# EAGLE design pci (EAGLE 6.5.0)
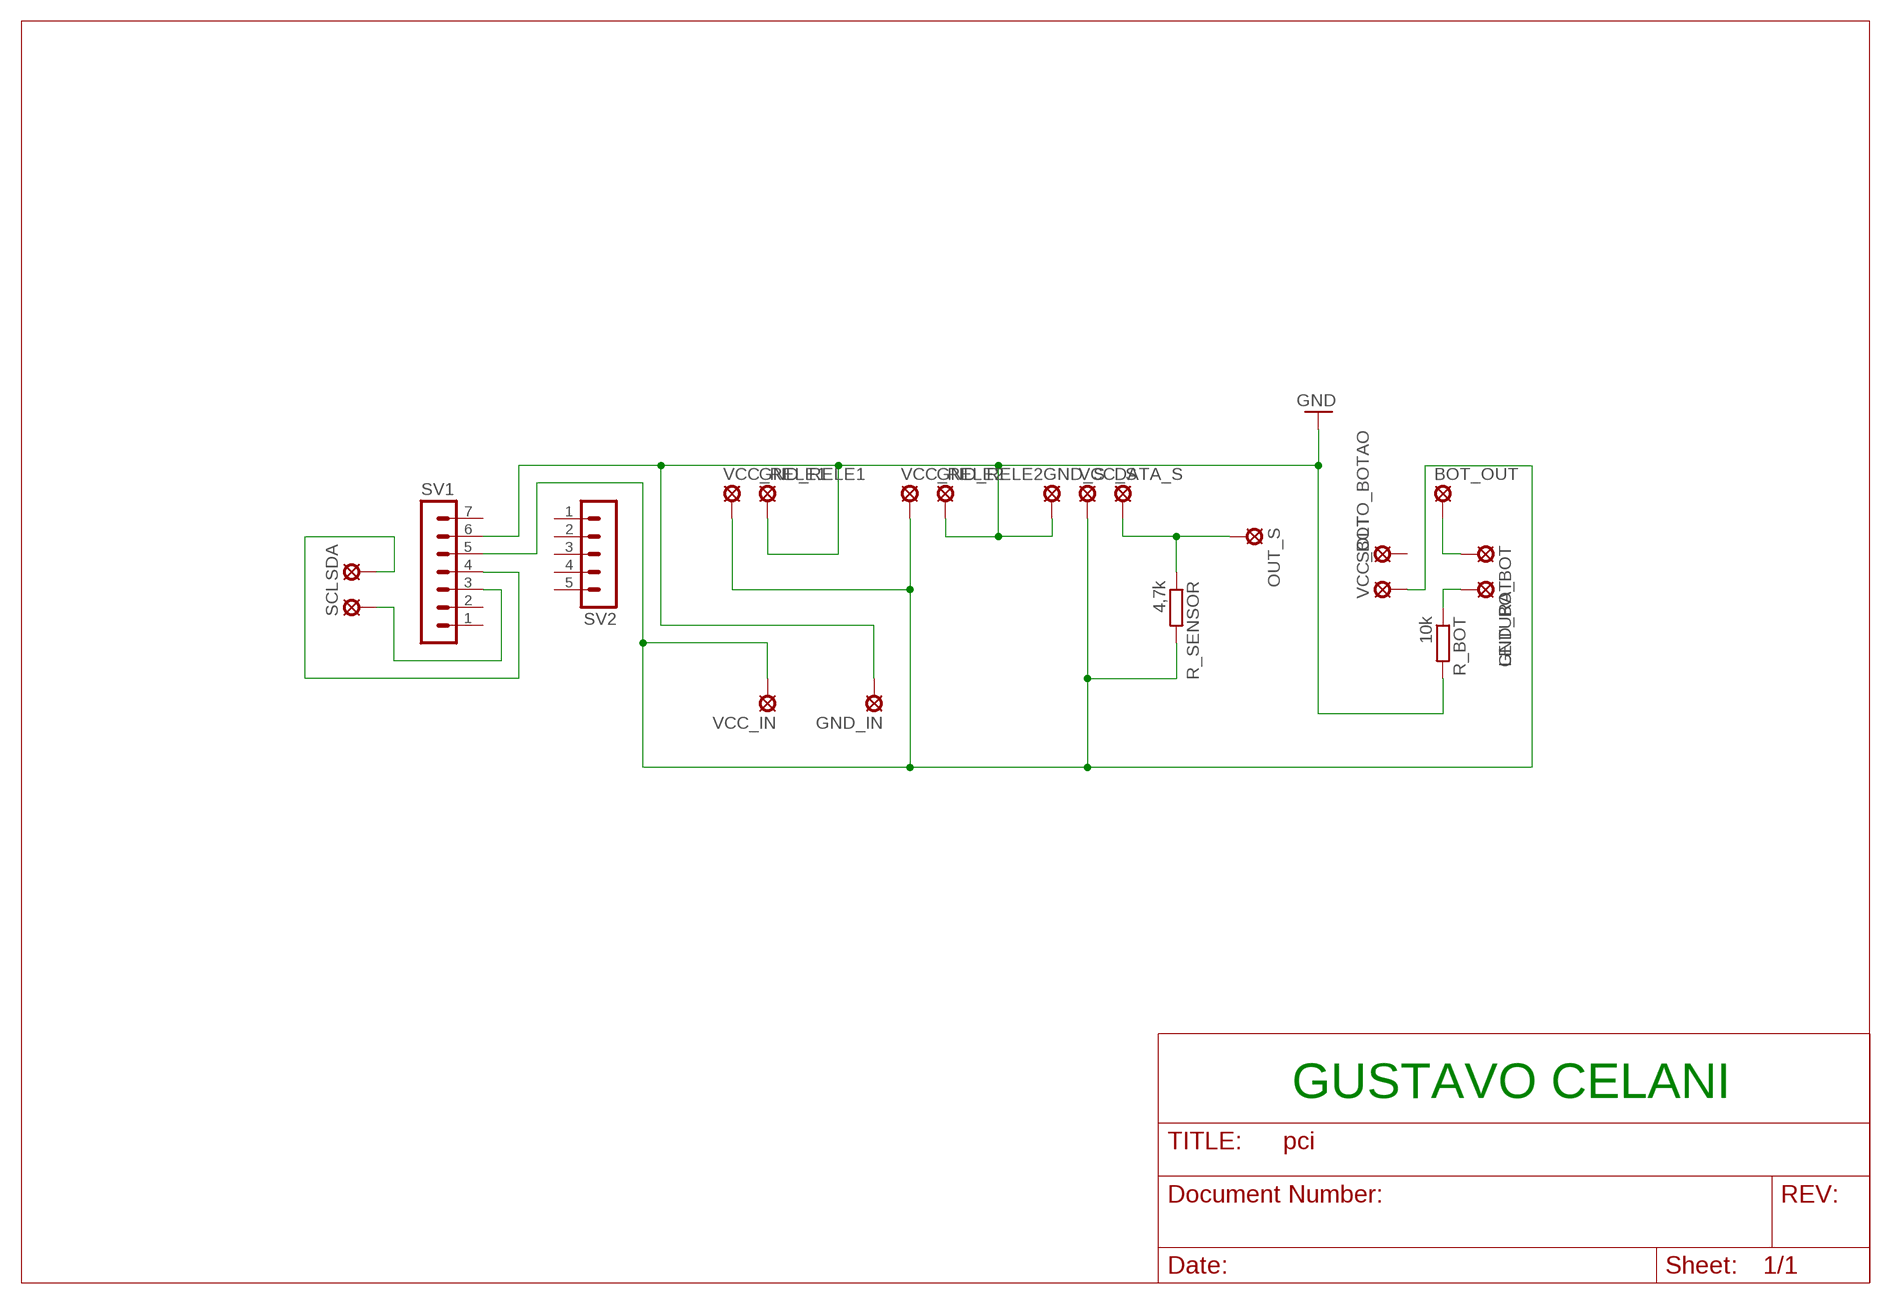
[diagram p0: schematic, sheet 1]

## Parts
BOT_OUT  SE11  [SE11]
DATA_S  SE11  [SE11]
GND_BOT  SE11  [SE11]
GND_IN  SE11  [SE11]
GND_RELE1  SE11  [SE11]
GND_RELE2  SE11  [SE11]
GND_S  SE11  [SE11]
LEITURA_BOT  SE11  [SE11]
OUT_S  SE11  [SE11]
R_BOT  10k  R-EU_0204/7  [0204/7]
R_SENSOR  4,7k  R-EU_0204/7  [0204/7]
SCL  SE11  [SE11]
SDA  SE11  [SE11]
SOLTO_BOTAO  SE11  [SE11]
SV1  MA07-1  [MA07-1]
SV2  MA05-1  [MA05-1]
VCC_BOT  SE11  [SE11]
VCC_IN  SE11  [SE11]
VCC_RELE1  SE11  [SE11]
VCC_RELE2  SE11  [SE11]
VCC_S  SE11  [SE11]

## Nets
GND: GND_IN.MP GND_RELE1.MP GND_RELE2.MP GND_S.MP R_BOT.2 SV1.6
N$1: DATA_S.MP OUT_S.MP R_SENSOR.1
N$2: R_SENSOR.2 SV1.5 VCC_BOT.MP VCC_IN.MP VCC_RELE1.MP VCC_RELE2.MP VCC_S.MP
N$3: SCL.MP SV1.3
N$4: SDA.MP SV1.4
N$5: BOT_OUT.MP LEITURA_BOT.MP
N$6: GND_BOT.MP R_BOT.1
Unconnected: SOLTO_BOTAO.MP SV1.1 SV1.2 SV1.7 SV2.1 SV2.2 SV2.3 SV2.4 SV2.5

## Notes on the sheet
- GUSTAVO CELANI

## Library data of the parts
BOT_OUT DATA_S GND_BOT GND_IN GND_RELE1 GND_RELE2 GND_S LEITURA_BOT OUT_S SCL SDA SOLTO_BOTAO VCC_BOT VCC_IN VCC_RELE1 VCC_RELE2 VCC_S = solpad:SE11: SOLDER PAD RTM, drill 1,1mm, distributor Buerklin, 07F810
R_BOT R_SENSOR = rcl:R-EU_: RESISTOR, European symbol
SV1 = con-lstb:MA07-1: PIN HEADER; OC_FARNELL: unknown; OC_NEWARK: unknown
SV2 = con-lstb:MA05-1: PIN HEADER; OC_FARNELL: unknown; OC_NEWARK: unknown

## Board
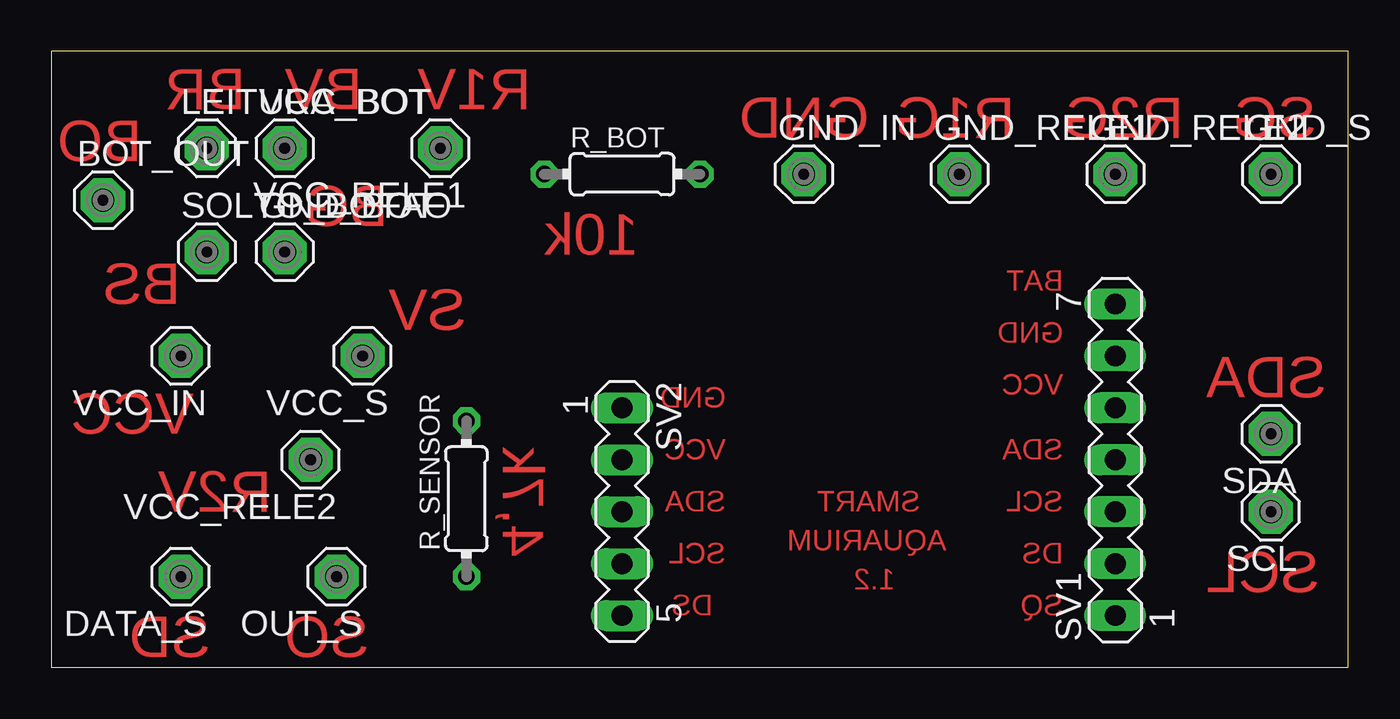
[diagram p1: board, top side]
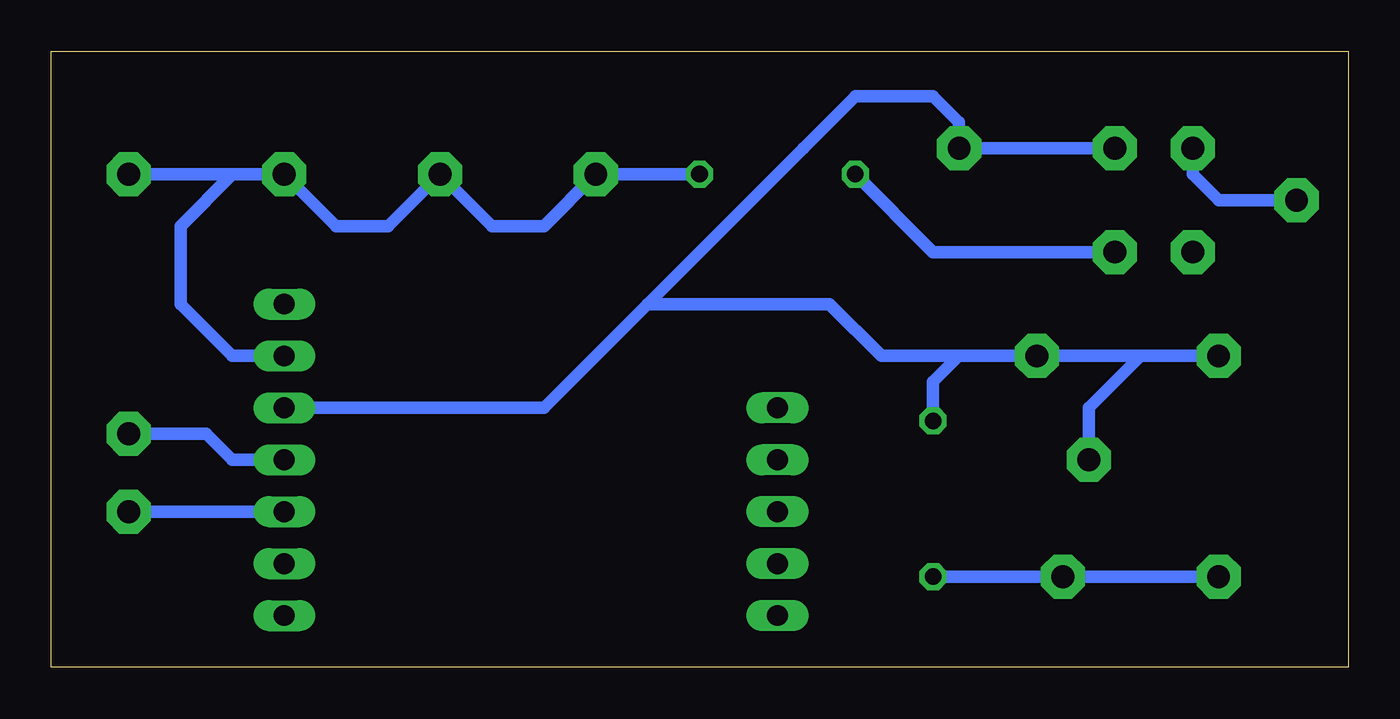
[diagram p2: board, bottom side, seen from below]

Size 63.48 x 30.15 mm. Coordinates in mm from the lower left corner, seen from the top.
Outline: 0,0 63.48,0 63.48,30.15 0,30.15 0,0
Copper layers (1*16): Top 0.035mm / dielectric 1.5mm / Bottom 0.035mm
Design rules "default": minimum track width 10mil, minimum drill 24mil, track to track 8mil, track to pad 8mil, pad to pad 8mil, via to via 8mil, smd to smd 8mil, copper to edge 40mil, drill to drill 8mil, minimum pad ring 10mil, minimum via ring 8mil, stop-mask expansion 4mil, vias tented up to drill 0mil, thermal gap 10mil

### Footprints (pad centres in the part's own frame; a part is rotated, then mirrored left to right if it is on the bottom)
SE11 = drill 1.118 pad 2.159 octagon: MP 0,0
0204/7 = drill 0.813 octagon: 1 -3.81,0; 2 3.81,0
MA07-1 = drill 1.016 long: 1 -7.62,0; 2 -5.08,0; 3 -2.54,0; 4 0,0; 5 2.54,0; 6 5.08,0; 7 7.62,0
MA05-1 = drill 1.016 long: 1 -5.08,0; 2 -2.54,0; 3 0,0; 4 2.54,0; 5 5.08,0

### Placement (x,y rotation side)
BOT_OUT  2.54,22.86 0 top
DATA_S  6.35,4.45 180 top
GND_BOT  11.43,20.32 0 top
GND_IN  36.83,24.13 0 top
GND_RELE1  44.45,24.13 0 top
GND_RELE2  52.07,24.13 0 top
GND_S  59.69,24.13 0 top
LEITURA_BOT  7.62,25.4 0 top
OUT_S  13.97,4.45 180 top
R_BOT  27.94,24.13 0 top
R_SENSOR  20.32,8.26 90 top
SCL  59.69,7.62 180 top
SDA  59.69,11.43 180 top
SOLTO_BOTAO  7.62,20.32 0 top
SV1  52.07,10.16 90 top
SV2  27.94,7.62 270 top
VCC_BOT  11.43,25.4 0 top
VCC_IN  6.35,15.24 180 top
VCC_RELE1  19.05,25.4 180 top
VCC_RELE2  12.7,10.16 180 top
VCC_S  15.24,15.24 180 top

### Tracks (layer width: path | path; a pad name or v marks a point on that pad's centre or on a via)
GND
  Bottom 0.61: SV1.6 54.61,15.24 57.15,17.78 57.15,21.59 54.61,24.13 | 54.61,24.13 GND_RELE2.MP 49.53,21.59 46.99,21.59 GND_RELE1.MP 41.91,21.59 39.37,21.59 GND_IN.MP R_BOT.2 | GND_S.MP 54.61,24.13
N$1
  Bottom 0.61: R_SENSOR.1 OUT_S.MP DATA_S.MP
N$2
  Bottom 0.607: VCC_RELE1.MP 19.05,26.67 20.32,27.94 24.13,27.94 26.67,25.4
  Bottom 0.61: VCC_RELE2.MP 12.7,12.7 10.16,15.24 VCC_IN.MP VCC_S.MP 19.05,15.24 | 19.05,15.24 20.32,13.97 R_SENSOR.2 | VCC_BOT.MP VCC_RELE1.MP | SV1.5 39.37,12.7 34.29,17.78 | 19.05,15.24 22.86,15.24 25.4,17.78 34.29,17.78 | 34.29,17.78 26.67,25.4
N$3
  Bottom 0.61: SV1.3 SCL.MP
N$4
  Bottom 0.61: SV1.4 54.61,10.16 55.88,11.43 SDA.MP
N$5
  Bottom 0.61: BOT_OUT.MP 6.35,22.86 7.62,24.13 LEITURA_BOT.MP
N$6
  Bottom 0.61: GND_BOT.MP 20.32,20.32 R_BOT.1

### Text on the board
Top: GND | R1G | R2G | SG | BR | BV | R1V | BO | BG | 10k | BS | BAT | SV | GND | SDA | GND | VCC | VCC | 4,7k | VCC | SDA | R2V | SDA | SMART | SCL | AQUARIUM | SCL | SCL | DS | 1.2 | SD | SO | DS | SQ